# Altium schematic sheet chipshouter-pico-mcu.SchDoc: RP2040 Microcontroller
size Letter; Organization: NewAE Technology Inc.; Address1: 1083 Queen St., Suite 196; Address2: Halifax; Address3: NS; Address4: Canada B3H 0B2; DocumentNumber: .; Revision: .; SheetNumber: 2; SheetTotal: 2; SheetApproved: YES
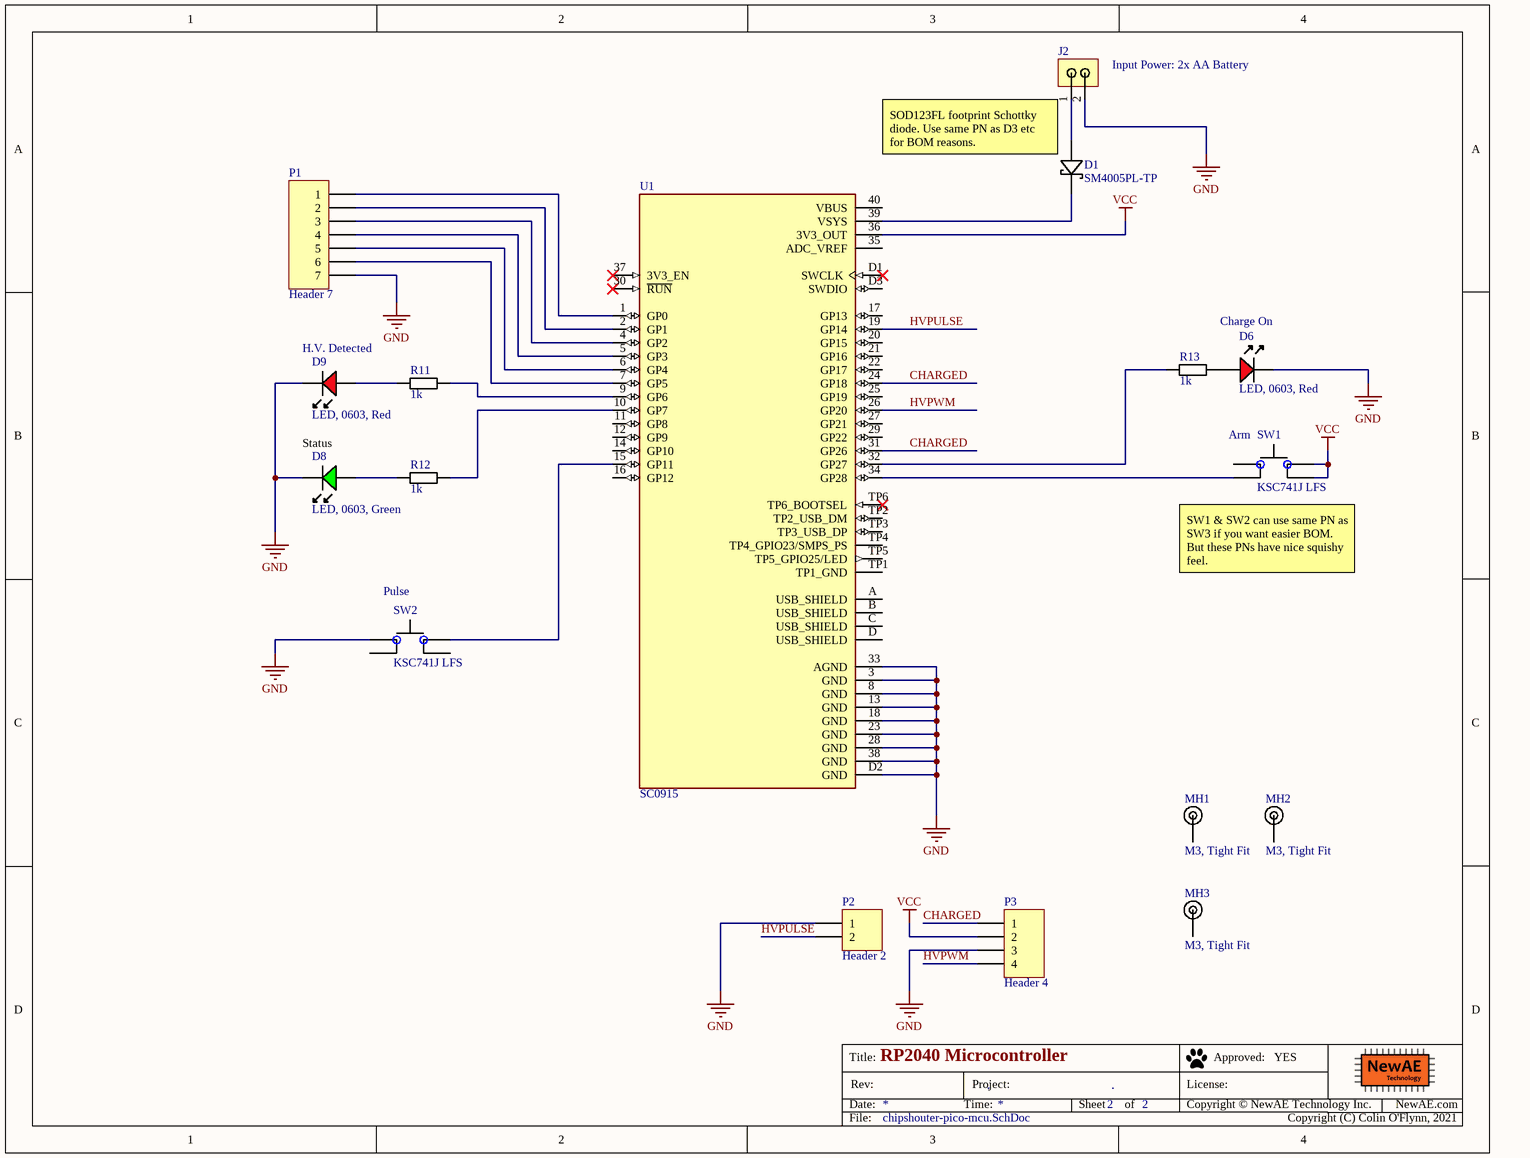
[diagram p0: chipshouter-pico-mcu.SchDoc]

## Parts
D1  SM4005PL-TP  [DSS13UTR]
D6  LED, 0603, Red  [LED-0603-RED]
D8  LED, 0603, Green  [LED-0603-GREEN]
D9  LED, 0603, Red  [LED-0603-RED]
J2  1x2_Pin_Header  [22-23-2021]  (value not drawn)
MH1  M3, Tight Fit  [MOUNT_M3_TIGHT]
MH2  M3, Tight Fit  [MOUNT_M3_TIGHT]
MH3  M3, Tight Fit  [MOUNT_M3_TIGHT]
P1  Header 7  [HDR1X7]
P2  Header 2  [HDR1X2]
P3  Header 4  [HDR1X4]
R11  1k  [RESC1608X55N]
R12  1k  [RESC1608X55N]
R13  1k  [RESC1608X55N]
SW1  KSC741J LFS  [CK_KSC7J]
SW2  KSC741J LFS  [CK_KSC7J]
U1  SC0915  [MODULE_SC0915_TH]

## Nets
GND: D6.K D8.K D9.K J2.2 P1.7 P2.1 P3.3 SW2.1(IN) U1.3(GND) U1.8(GND) U1.13(GND) U1.18(GND) U1.23(GND) U1.28(GND) U1.33(AGND) U1.38(GND) U1.D2(GND)
VCC: P3.2 SW1.2(IN) SW1.3(IN) U1.36(3V3_OUT)
CHARGED: P3.1 U1.24(GP18) U1.31(GP26)
HVPULSE: P2.2 U1.19(GP14)
HVPWM: P3.4 U1.26(GP20)
NetD1_A: D1.A J2.1
NetD1_K: D1.K U1.39(VSYS)
NetD6_A: D6.A R13.1
NetD8_A: D8.A R12.1
NetD9_A: D9.A R11.1
NetP1_1: P1.1 U1.1(GP0)
NetP1_2: P1.2 U1.2(GP1)
NetP1_3: P1.3 U1.4(GP2)
NetP1_4: P1.4 U1.5(GP3)
NetP1_5: P1.5 U1.6(GP4)
NetP1_6: P1.6 U1.7(GP5)
NetR11_2: R11.2 U1.9(GP6)
NetR12_2: R12.2 U1.10(GP7)
NetR13_2: R13.2 U1.32(GP27)
NetSW1_4: SW1.4(IN) U1.34(GP28)
NetSW2_2: SW2.2(IN) U1.15(GP11)

Not connected (* = marked no-connect by the designer): MH1 1; MH2 1; MH3 1; SW1 1(IN); SW2 3(IN) 4(IN); U1 11(GP8) 12(GP9) 14(GP10) 16(GP12) 17(GP13) 20(GP15) 21(GP16) 22(GP17) 25(GP19) 27(GP21) 29(GP22) 30(~{RUN})* 35(ADC_VREF) 37(3V3_EN)* 40(VBUS) A(USB_SHIELD) B(USB_SHIELD) C(USB_SHIELD) D(USB_SHIELD) D1(SWCLK)* D3(SWDIO) TP1(TP1_GND) TP2(TP2_USB_DM) TP3(TP3_USB_DP) TP4(TP4_GPIO23/SMPS_PS) TP5(TP5_GPIO25/LED) TP6(TP6_BOOTSEL)*

## Notes on the sheet
- (near J2) Input Power: 2x AA Battery
- (near D1) SOD123FL footprint Schottky diode. Use same PN as D3 etc for BOM reasons.
- H.V. Detected
- Charge On
- (near SW1) Arm
- Status
- (near SW1) SW1 & SW2 can use same PN as SW3 if you want easier BOM. But these PNs have nice squishy feel.
- (near SW2) Pulse
- Copyright (C) Colin O'Flynn, 2021
- Title:
- Date:
- Rev:
- Time:
- Project:
- Sheet
- of
- License:
- Copyright © NewAE Technology Inc.
- Approved:
- NewAE.com
- File:

## Library data of the parts
D1 = DSS13UTR: SCHOTTKY 30V SOD-123FL; Manufacture 1: MCC; Component Group: Diode; PP Material Stack: 0; Part Number: DSS13UTR; Manufacture Part Number 1: SM4005PL-TP; Pin Count: 2; Supplier 1: Digi-Key; Supplier Part Number 1: 1655-1926-1-ND; Mounting Technology: SMT; RoHS: Yes; Component Kind: Standard; Component Type: Standard; PP Rotation: 0
D6 D9 = LEDCHIP_0603_RED: Chip LED, Red; Manufacture 1: Kingbright; Manufacture Part Number 1: APT1608SRCPRV; Component Group: Optical; PP Material Stack: 15; PP Rotation: -90; Part Number: LEDCHIP_0603_RED; Pin Count: 2; Supplier 1: Digi-Key; Supplier Part Number 1: 754-1122-1-ND; Mounting Technology: SMT; Component Kind: Standard; Component Type: Standard
D8 = LEDCHIP_0603_GREEN: Chip LED, Green; Manufacture 1: Kingbright; Manufacture Part Number 1: APT1608CGCK; Component Group: Optical; PP Material Stack: 16; PP Rotation: -90; Part Number: LEDCHIP_0603_GREEN; Pin Count: 2; Supplier 1: Digi-Key; Supplier Part Number 1: 754-1116-1-ND; Mounting Technology: SMT; Component Kind: Standard; Component Type: Standard
J2 = Molex_2_Pin: CONN HEADER 2POS .100 VERT TIN; Manufacture 1: Molex; Manufacture Part Number 1: 22-23-2021 / 22-23-2021; Component Group: Connector; PP Material Stack: 0; Part Number: Molex_2_Pin; Pin Count: 2; Supplier 1: Digi-Key; Supplier Part Number 1: WM4200-ND; Mounting Technology: Through-hole; RoHS: Yes; Component Kind: Standard; Component Type: Standard; PP Rotation: 0
MH1-MH3 = MOUNT_M3_TIGHT: Machine screw M3 Mounting Hole; Component Group: Mechanical; PP Material Stack: 0; Part Number: MOUNT_M3_TIGHT; Pin Count: 1; Component Kind: Mechanical; Component Type: Mechanical; PP Rotation: 0
P1 = Header 7: Header, 7-Pin; LatestRevisionDate: 17-Jul-2002; LatestRevisionNote: Re-released for DXP Platform.; Publisher: Altium Limited
P2 = Header 2: Header, 2-Pin; LatestRevisionDate: 17-Jul-2002; LatestRevisionNote: Re-released for DXP Platform.; Publisher: Altium Limited
P3 = Header 4: Header, 4-Pin; LatestRevisionDate: 17-Jul-2002; LatestRevisionNote: Re-released for DXP Platform.; Publisher: Altium Limited
R11-R13 = RCHIP-1K-0603: 1k res, 0603, 1%, 1/10W; Manufacture 1: Yageo; Manufacture Part Number 1: RC0603FR-071KL; Component Group: Resistor; Case-EIA: 0603; Case-Metric: 1608; Rated Power: 0.1W; Rated Voltage: 75VDC; Part Number: RCHIP-1K-0603; Footprint: 0603; Pin Count: 2; Supplier 1: Digi-Key; Supplier Part Number 1: 311-1.00KHRCT-ND; Value: 1k; Tolerance: 1%; Mounting Technology: SMT; Temperature Range: -55C to 155C; Component Kind: Standard; Component Type: Standard
SW1 SW2 = TACTSW-KSC741J: SWITCH TACTILE SPST-NO 0.01A 32V; Manufacture 1: C&K; PP Material Stack: 0; Part Number: TACTSW-KSC741J; Component Group: Switch; Manufacture Part Number 1: KSC741J LFS; Pin Count: 4; Supplier 1: Digi-Key; Supplier Part Number 1: CKN10309CT-ND; Mounting Technology: SMT; RoHS: Yes; Component Kind: Standard; Component Type: Standard; PP Rotation: 0
U1 = SC0915: Raspberry Pi Pico; Component Group: PCB Feature; PP Material Stack: 0; SnapEDA_Link: https://www.snapeda.com/parts/SC0915/Raspberry%20Pi/view-part/6331605/?ref=snap; Package: None; Purchase-URL: https://pricing.snapeda.com/search/part/SC0915/?ref=eda; Availability: In Stock; Price: None; MP: SC0915; Check_prices: https://www.snapeda.com/parts/SC0915/Raspberry%20Pi/view-part/6331605/?ref=eda; MF: Raspberry Pi; Value: *; Part Number: SC0915; Component Kind: Standard; Component Type: Standard; PP Rotation: 0; PP Rotation1: 0